# EAGLE design GainBlock (EAGLE 9.4.0)
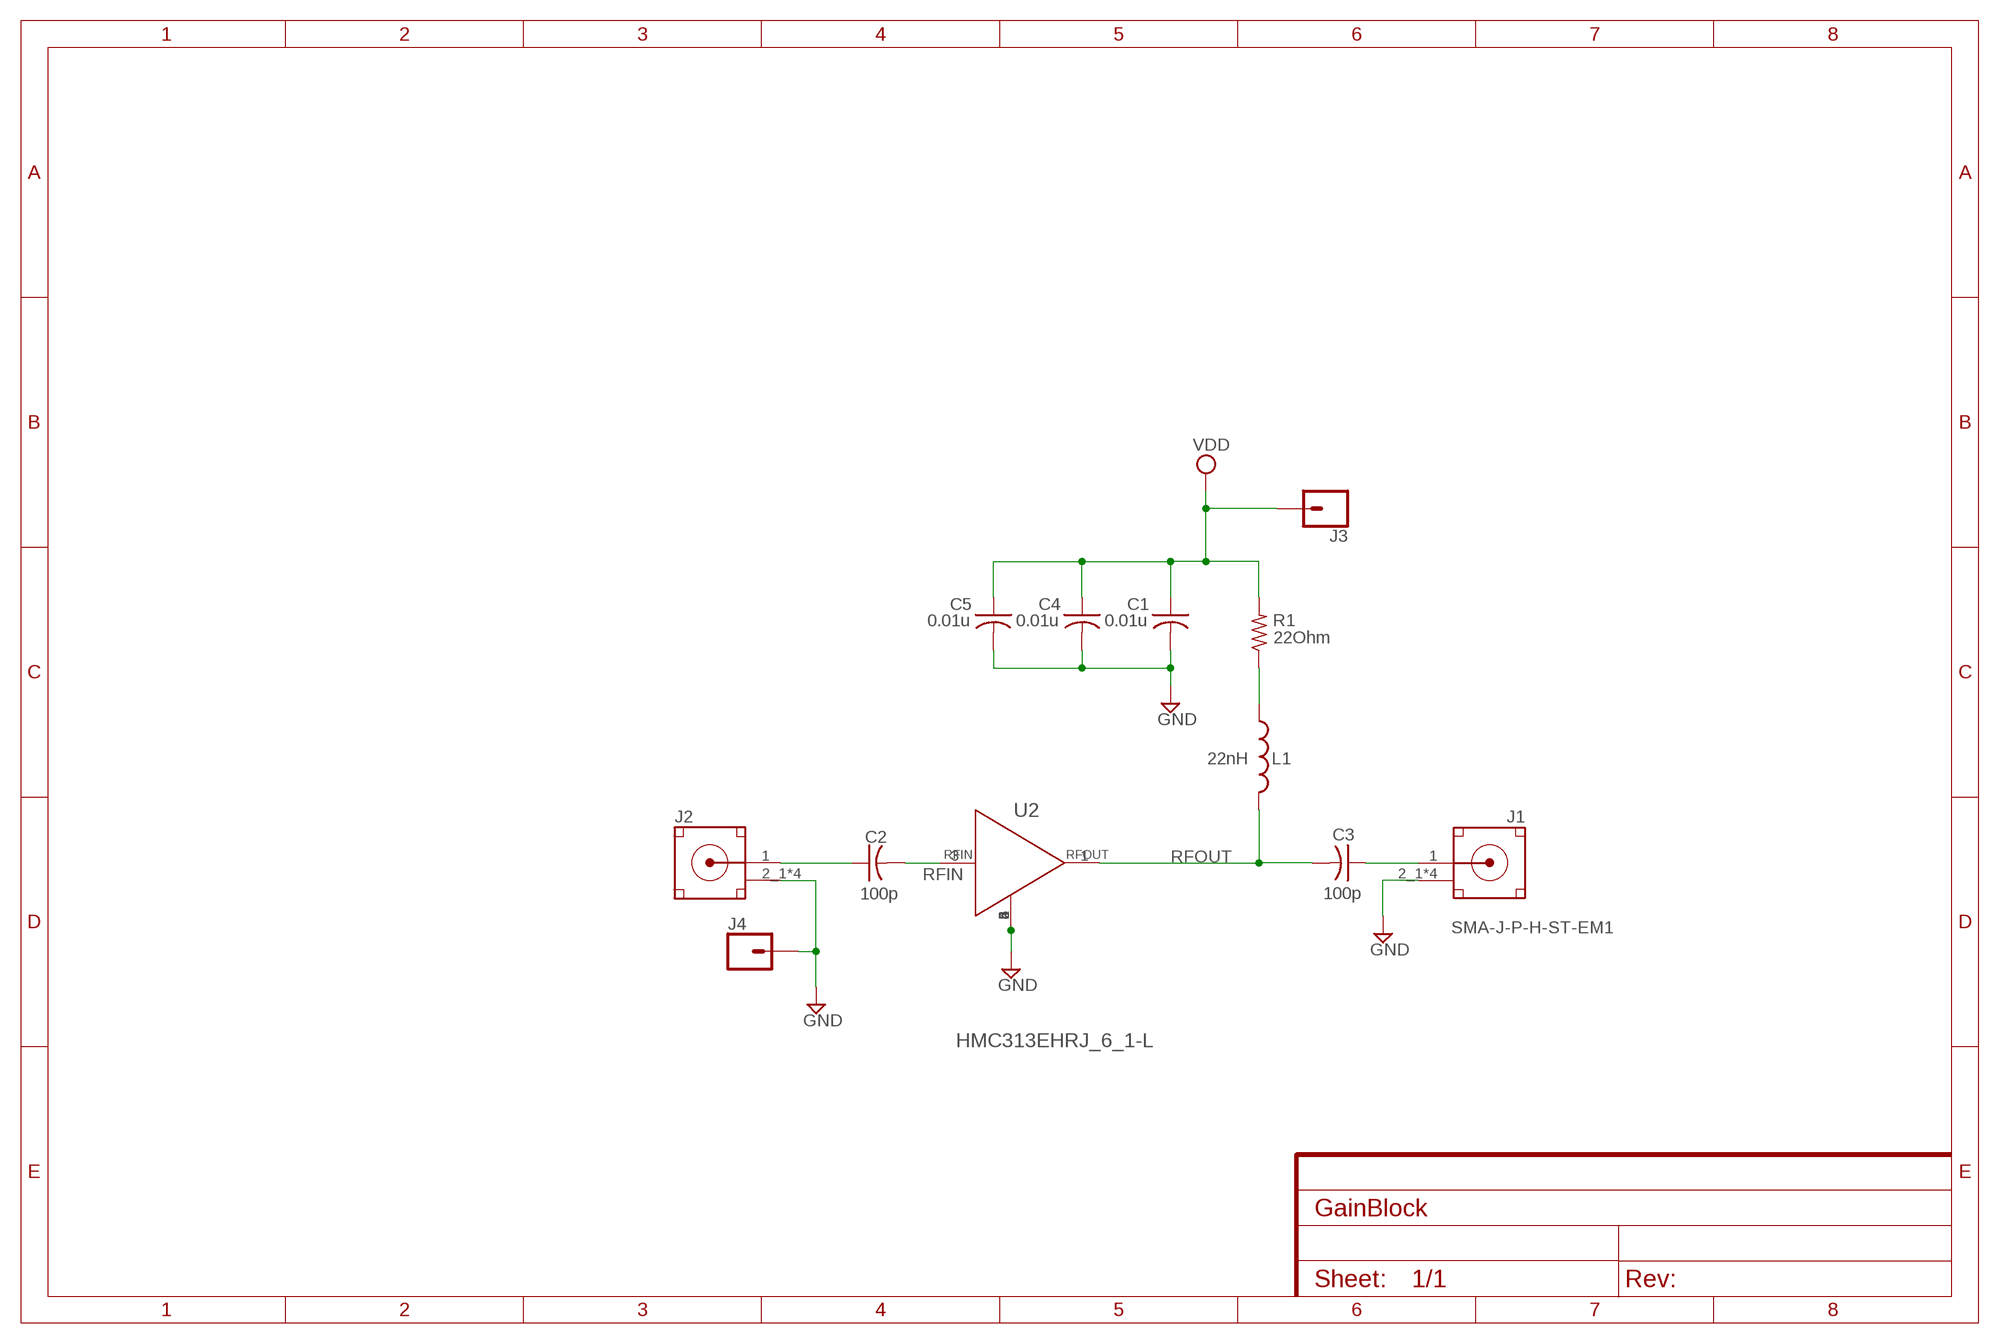
[diagram p0: schematic, sheet 1]

## Parts
C1  0.01u  C-USC0805  [C0805]
C2  100p  C-USC0805  [C0805]
C3  100p  C-USC0805  [C0805]
C4  0.01u  C-USC0805  [C0805]
C5  0.01u  C-USC0805  [C0805]
J1  SMA-J-P-H-ST-EM1  [SMA-J-P-H-ST-EM1]
J2  SMA-J-P-H-ST-EM1  [SMA-J-P-H-ST-EM1]
J3  CONN_01  [1X01]
J4  CONN_01  [1X01]
L1  22nH  L-USL0805  [L0805]
R1  22Ohm  R-US_R0805  [R0805]
U2  HMC313EHRJ_6_1-L  [HRJ_6_1-L]

## Nets
GND: C1.2 C4.2 C5.2 J1.2_1(GND) J1.2_2(GND) J1.3_1(GND) J1.3_2(GND) J2.2_1(GND) J2.2_2(GND) J2.3_1(GND) J2.3_2(GND) J4.1 U2.2(GND_2) U2.4(GND_3) U2.5(GND_4) U2.6(GND)
N$1: C2.1 J2.1(SIGNAL)
N$3 [RF]: C3.1 J1.1(SIGNAL)
N$4: L1.1 R1.1
RFIN: C2.2 U2.3(RFIN)
RFOUT [RF]: C3.2 L1.2 U2.1(RFOUT)
VDD: C1.1 C4.1 C5.1 J3.1 R1.2

## Library data of the parts
C1-C5 = rcl-2:C-US: CAPACITOR, American symbol
J1 J2 = SMA-J-P-H-ST-EM1:SMA-J-P-H-ST-EM1: Connector SMA F 50Ohm Solder ST Edge Mount Gold Over Nickel Tray; DESCRIPTION: Connector SMA F 50Ohm Solder ST Edge Mount Gold Over Nickel Tray; DIGI-KEY_PART_NUMBER: SAM8857-ND; DIGI-KEY_PURCHASE_URL: https://www.digikey.com/product-detail/en/samtec-inc/SMA-J-P-H-ST-EM1/SAM8857-ND/2602450?utm_source=snapeda&utm_medium=aggregator&utm_campaign=symbol; MF: Samtec; MP: SMA-J-P-H-ST-EM1; PACKAGE: None
J3 J4 = SparkFun-Connectors:CONN_01: Single connection point. Often used as Generic Header-pin footprint for 0.1 inch spaced/style header connections On any of the 0.1 inch spaced packages, you can populate with these: Break Away Headers - Straight <https://www.sparkfun.com/products/116> (PRT-00116) Break Away Male Headers - Right Angle <https://www.sparkfun.com/products/553> (PRT-00553) Female Headers <https://www.sparkfun.com/products/115> (PRT-00115) Break Away Headers - Machine Pin <https://www.sparkfun.com/products/117> (PRT-00117) Break Away Female Headers - Swiss Machine Pin <https://www.sparkfun.com/products/743> (PRT-00743) This device is also useful as a general connection point to wire up your design to another part of your project. Our various solder wires solder well into these plated through hole pads. Hook-Up Wire - Assortment (Stranded, 22 AWG) <https://www.sparkfun.com/products/11375> (PRT-11375) Hook-Up Wire - Assortment (Solid Core, 22 AWG) <https://www.sparkfun.com/products/11367> (PRT-11367) View the entire wire category on our website here <https://www.sparkfun.com/categories/141> Special notes: SMTSO-256-ET is a "flush mount" nut for a 4-40 screw. We mostly use this on specialty testbeds; it is a nice way to connect hardware to your PCB at an adjustable hieght. Also note, the SNAP packages are for using a snappable style connector. We sell a baggie of snaps and they are also used on two LilyPad designs: Snap Assortment - 30 pack (male and female) <https://www.sparkfun.com/products/11347> (DEV-11347) LilyPad Arduino SimpleSnap <https://www.sparkfun.com/products/10941> (DEV-10941) LilyPad SimpleSnap Protoboard <https://www.sparkfun.com/products/10940> (DEV-10940)
L1 = rcl-2:L-US: INDUCTOR, American symbol
R1 = rcl-2:R-US_: RESISTOR, American symbol
U2 = HMC313:HMC313E; MANUFACTURER_PART_NUMBER: HMC313E; VENDOR: Analog Devices Inc

## Net classes
0 default: width 0.254 mm, drill 0.508 mm, clearance 0.4 mm
1 RF: drill 0.508 mm, clearance 0.4 mm
2 RF/2: drill 0.508 mm, clearance 0.4 mm

## Board
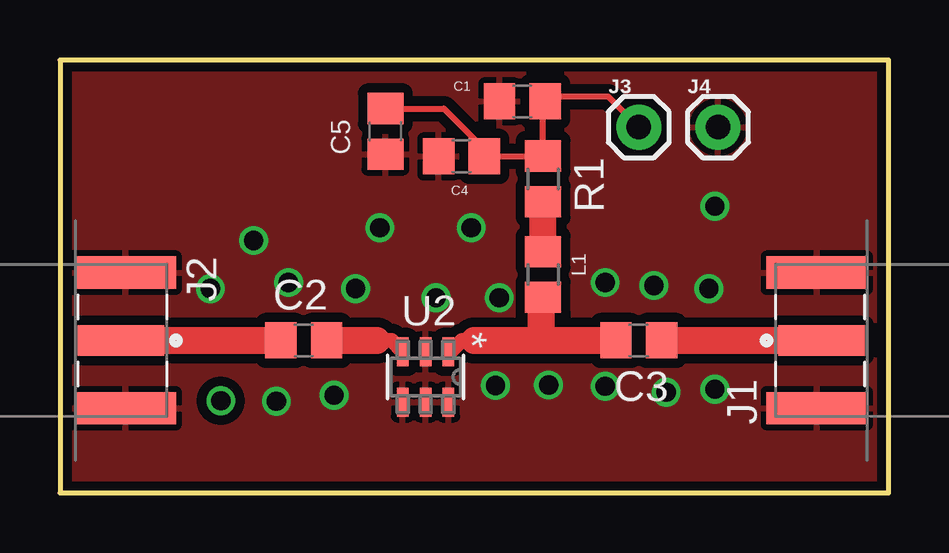
[diagram p1: board, top side]
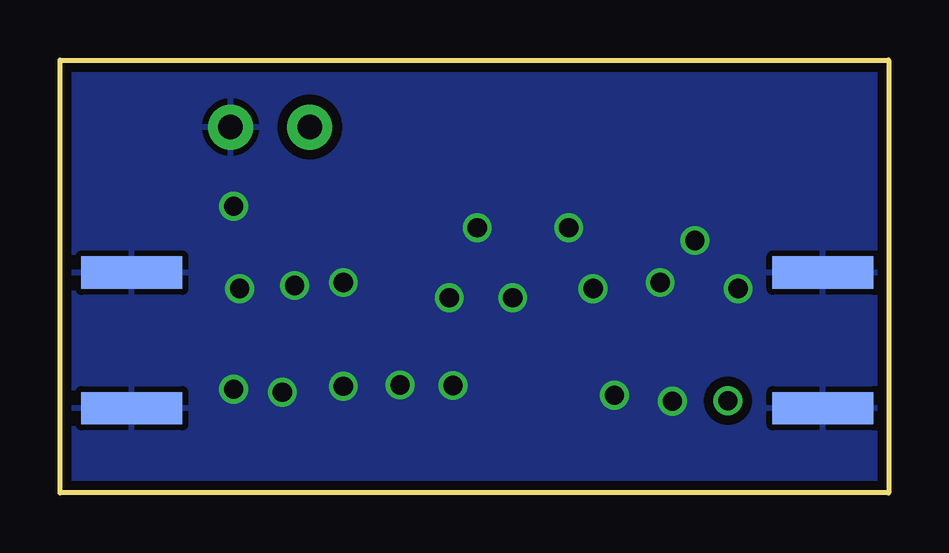
[diagram p2: board, bottom side, seen from below]

Size 34.54 x 18.03 mm. Coordinates in mm from the lower left corner, seen from the top.
Outline: 0,18.03 0,0 34.54,0 34.54,18.03 0,18.03
Copper layers (1*16): Top 0.035559375mm / dielectric 1.6mm / Bottom 0.035559375mm
Design rules "oshpark-2layer": minimum track width 6mil, minimum drill 10mil, track to track 6mil, track to pad 6mil, pad to pad 6mil, via to via 6mil, smd to smd 6mil, copper to edge 15mil, drill to drill 6mil, minimum pad ring 5mil, minimum via ring 5mil, stop-mask expansion 2.5mil, vias tented up to drill 0mil, thermal gap 10mil

### Footprints (pad centres in the part's own frame; a part is rotated, then mirrored left to right if it is on the bottom)
C0805 = smd 1.3 x 1.5: 1 -0.95,0; 2 0.95,0
SMA-J-P-H-ST-EM1 = smd 1.27 x 3.6: 1 0,0 | smd 1.35 x 4.2: 2_1 -2.825,0.2; 3_1 2.825,0.2 | smd 1.35 x 4.2 bottom: 2_2 -2.825,0.2; 3_2 2.825,0.2
1X01 = drill 1.016 pad 1.88: 1 0,0
L0805 = smd 1.3 x 1.5: 1 -0.95,0; 2 0.95,0
R0805 = smd 1.3 x 1.5: 1 -0.95,0; 2 0.95,0
HRJ_6_1-L = smd 1.206 x 0.48: 1 -1.049,0.95; 2 -1.049,0; 3 -1.049,-0.95; 4 1.049,-0.95; 5 1.049,0; 6 1.049,0.95

### Placement (x,y rotation side)
C1  19.28,16.31 180 top
C2  10.16,6.35 0 top
C3  24.13,6.35 180 top
C4  16.74,14.02 180 top
C5  13.56,15.06 270 top
J1  31.75,6.35 90 top
J2  2.54,6.35 270 top
J3  24.13,15.24 0 top
J4  27.43,15.24 0 top
L1  20.14,9.09 270 top
R1  20.14,13.08 90 top
U2  15.24,4.83 270 top

### Tracks (layer width: path | path; a pad name or v marks a point on that pad's centre or on a via)
GND  (via drill 0.8)
  other vias: 6.27,8.51 9.02,3.81 11.43,4.06 15.67,8.13 18.31,8.13 18.16,4.47 20.37,4.5 27.3,11.94 12.32,8.51 27.3,4.32 8.08,10.52 24.77,8.64 13.34,11.05 27.05,8.51 22.73,4.44 9.53,8.76 25.27,4.19 17.14,11.05 22.73,8.76
  pour Bottom (isolate 0.305): 0,18.03 34.54,18.03 34.54,0 0,0
  pour Top: 0,18.03 34.54,18.03 34.54,0 0,0
GND2  (via drill 0.8)
  other vias: 6.71,3.84
N$1
  Top 1.118: J2.1 C2.1
N$3
  Top 1.118: C3.1 J1.1
N$4
  Top 1.118: L1.1 R1.1
RFIN
  Top 0.61: 13.21,6.35 13.82,6.35 U2.3
  Top 1.118: C2.2 13.21,6.35
RFOUT
  Top 0.61: U2.1 16.29,5.87 16.76,6.35 17.27,6.35
  Top 1.118: 17.27,6.35 20.07,6.35 | 20.07,6.35 C3.2 | 20.07,6.35 20.07,8.07 L1.2
VDD
  Top 0.254: C5.1 16,16.01 17.7,14.31 17.7,14.03 | J3.1 22.86,16.51 20.43,16.51 20.25,16.33 20.14,16.22 R1.2 17.7,14.03 | C4.1 17.7,14.03
  Top 1.118: 20.14,16.22 C1.1